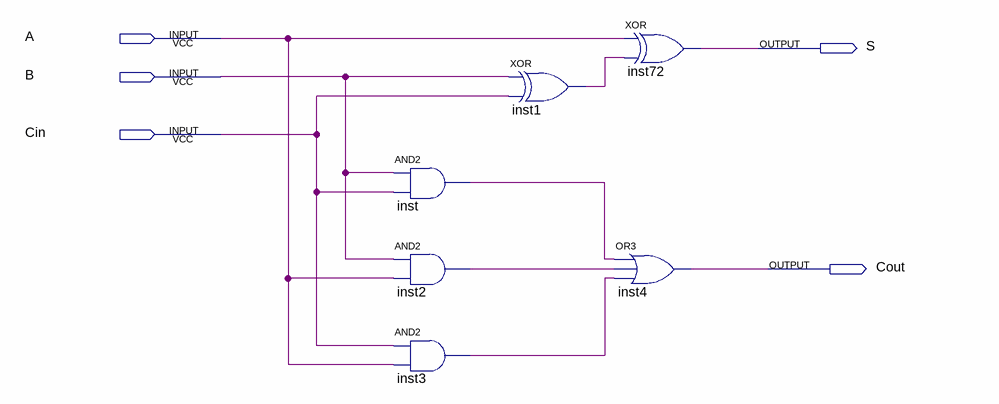
[diagram p0: schematic sheet]
// Quartus schematic somatore.bdf as structural Verilog: 6 symbols, 5 pins
module somatore (
  input  A,
  input  B,
  input  Cin,
  output S,
  output Cout
);

  wire inst1_out, inst2_out, inst3_out, inst_out;

  and inst (inst_out, B, Cin);
  and inst2 (inst2_out, B, A);
  and inst3 (inst3_out, Cin, A);
  xor inst1 (inst1_out, B, Cin);
  xor inst72 (S, A, inst1_out);
  or inst4 (Cout, inst_out, inst2_out, inst3_out);
endmodule
